# EAGLE design 706_breakout_i2c_2mm (EAGLE 9.6.2)
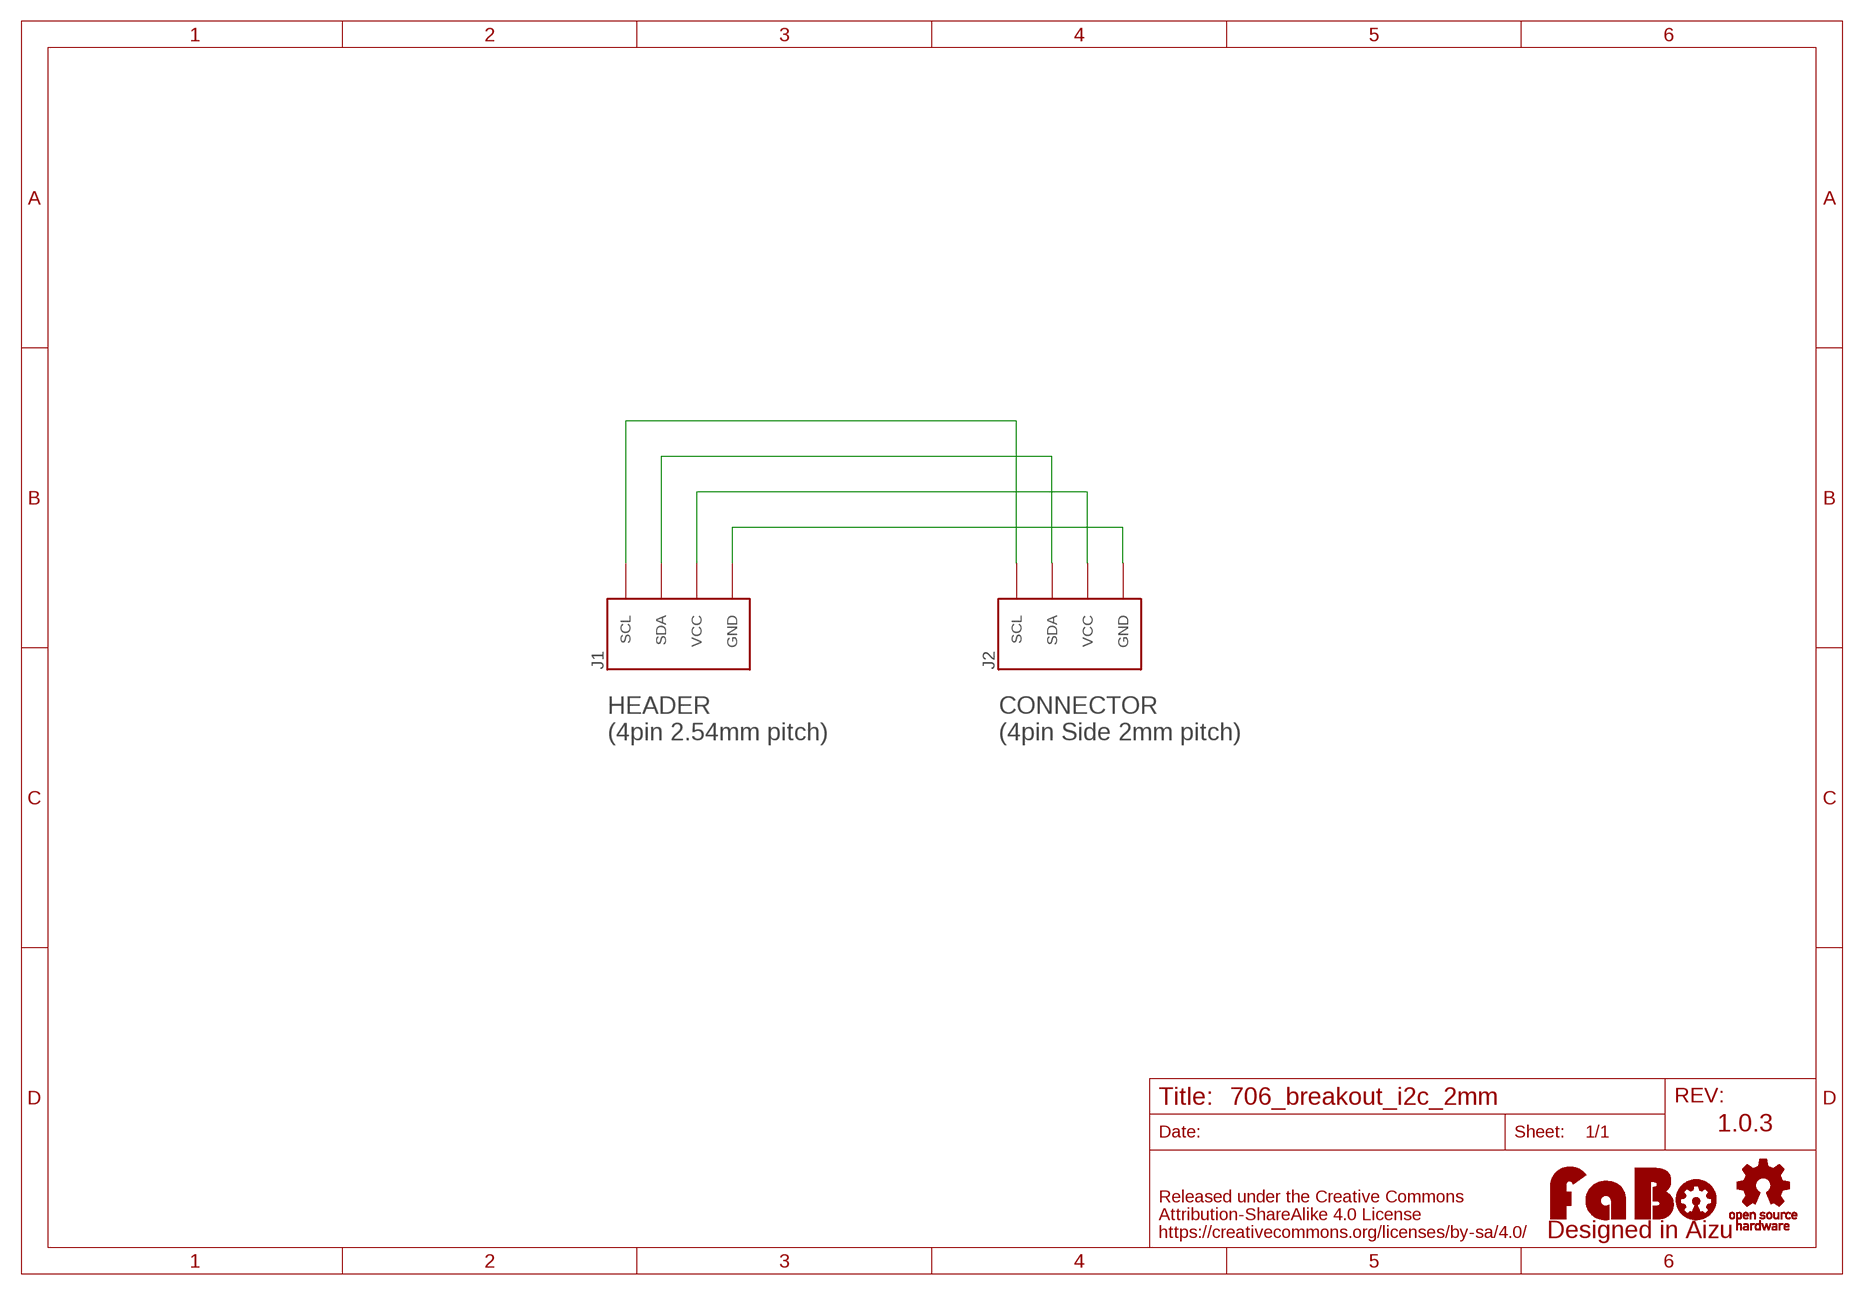
[diagram p0: schematic, sheet 1]

## Parts
J1  FABO_BRICK_I2C-BREAKOUT  [FABO_BRICK_I2C_BREAKOUT]
J2  FABO_BRICK_I2C-S04B-PASK-2  [FABO_BRICK_I2C_S04B-PASK-2]
U$2  LOGO_FABO-M_BOTTOM  [LOGO_FABO_MS_BOTTOM]
U$3  LOGO_OSHW-S_BOTTOM  [LOGO_OSHW_S_BOTTOM]

## Nets
GND: J1.GND J2.GND
SCL: J1.SCL J2.SCL
SDA: J1.SDA J2.SDA
VCC: J1.VCC J2.VCC

## Notes on the sheet
- HEADER
  (4pin 2.54mm pitch)
- CONNECTOR
  (4pin Side 2mm pitch)
- 1.0.3

## Library data of the parts
J1 J2 = FaBo-Template:FABO_BRICK_I2C: FaBo Brick I2C
U$2 = FaBo-Logo:LOGO_FABO
U$3 = FaBo-etc:LOGO_OSHW

## Board
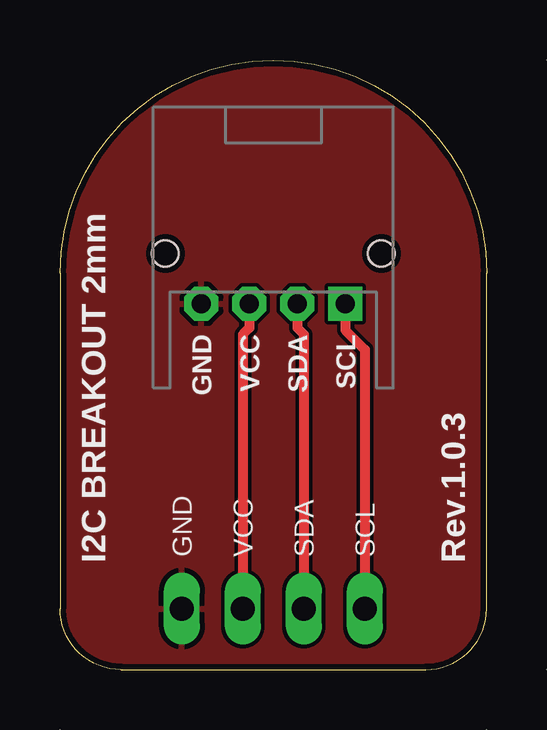
[diagram p1: board, top side]
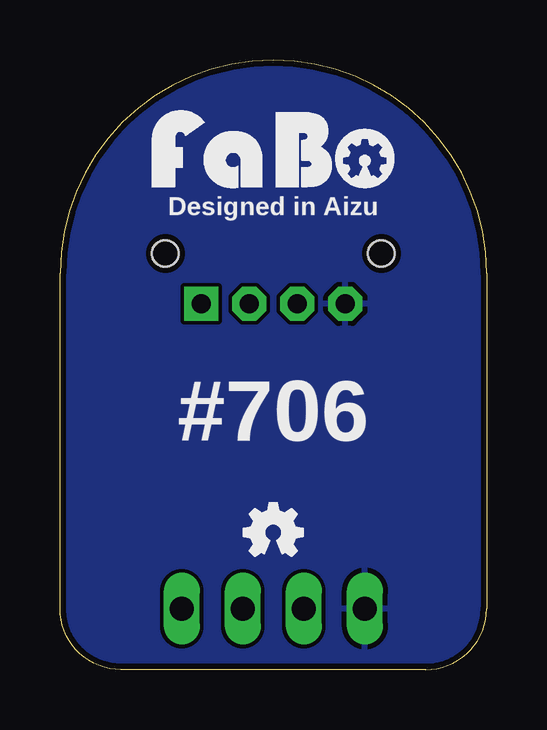
[diagram p2: board, bottom side, seen from below]

Size 17.78 x 25.4 mm. Coordinates in mm from the lower left corner, seen from the top.
Copper layers (1*16): Top 0.035mm / dielectric 1.6mm / Bottom 0.035mm
Design rules "PCBway": minimum track width 6mil, minimum drill 12mil, track to track 6mil, track to pad 6mil, pad to pad 6mil, via to via 6mil, smd to smd 6mil, copper to edge 10mil, drill to drill 10mil, minimum pad ring 10mil, minimum via ring 6mil, stop-mask expansion 2mil, vias tented up to drill 100mil, thermal gap 8mil

### Footprints (pad centres in the part's own frame; a part is rotated, then mirrored left to right if it is on the bottom)
FABO_BRICK_I2C_BREAKOUT = drill 1 long: GND -3.81,-10.16; SCL 3.81,-10.16; SDA 1.27,-10.16; VCC -1.27,-10.16
FABO_BRICK_I2C_S04B-PASK-2 = drill 0.8 pad 1.422 octagon: GND -3,0; SDA 1,0; VCC -1,0 | drill 0.8 pad 1.422 square: SCL 3,0 | hole 1.1: 4.5,2.1; -4.5,2.1

### Placement (x,y rotation side)
J1  8.89,12.7 0 top
J2  8.89,15.24 0 top
U$2  8.89,19.68 0 top
U$3  8.89,5.71 0 top

### Tracks (layer width: path | path; a pad name or v marks a point on that pad's centre or on a via)
GND
  pour Bottom: -1.27,-1.27 19.05,-1.27 19.05,26.67 -1.27,26.67
  pour Top: -1.27,-1.27 19.05,-1.27 19.05,26.67 -1.27,26.67
SCL
  Top 0.406: J2.SCL 11.89,14.14 12.7,13.34 J1.SCL
SDA
  Top 0.406: J2.SDA 9.89,14.24 10.16,13.97 J1.SDA
VCC
  Top 0.406: J2.VCC 7.89,14.24 7.62,13.97 J1.VCC

### Text on the board
tPlace: GND | VCC | SDA | SCL | I2C BREAKOUT 2mm | Rev.1.0.3
bPlace: Designed in Aizu | #706